# EAGLE design attiny_cortana (EAGLE 7.7.0)
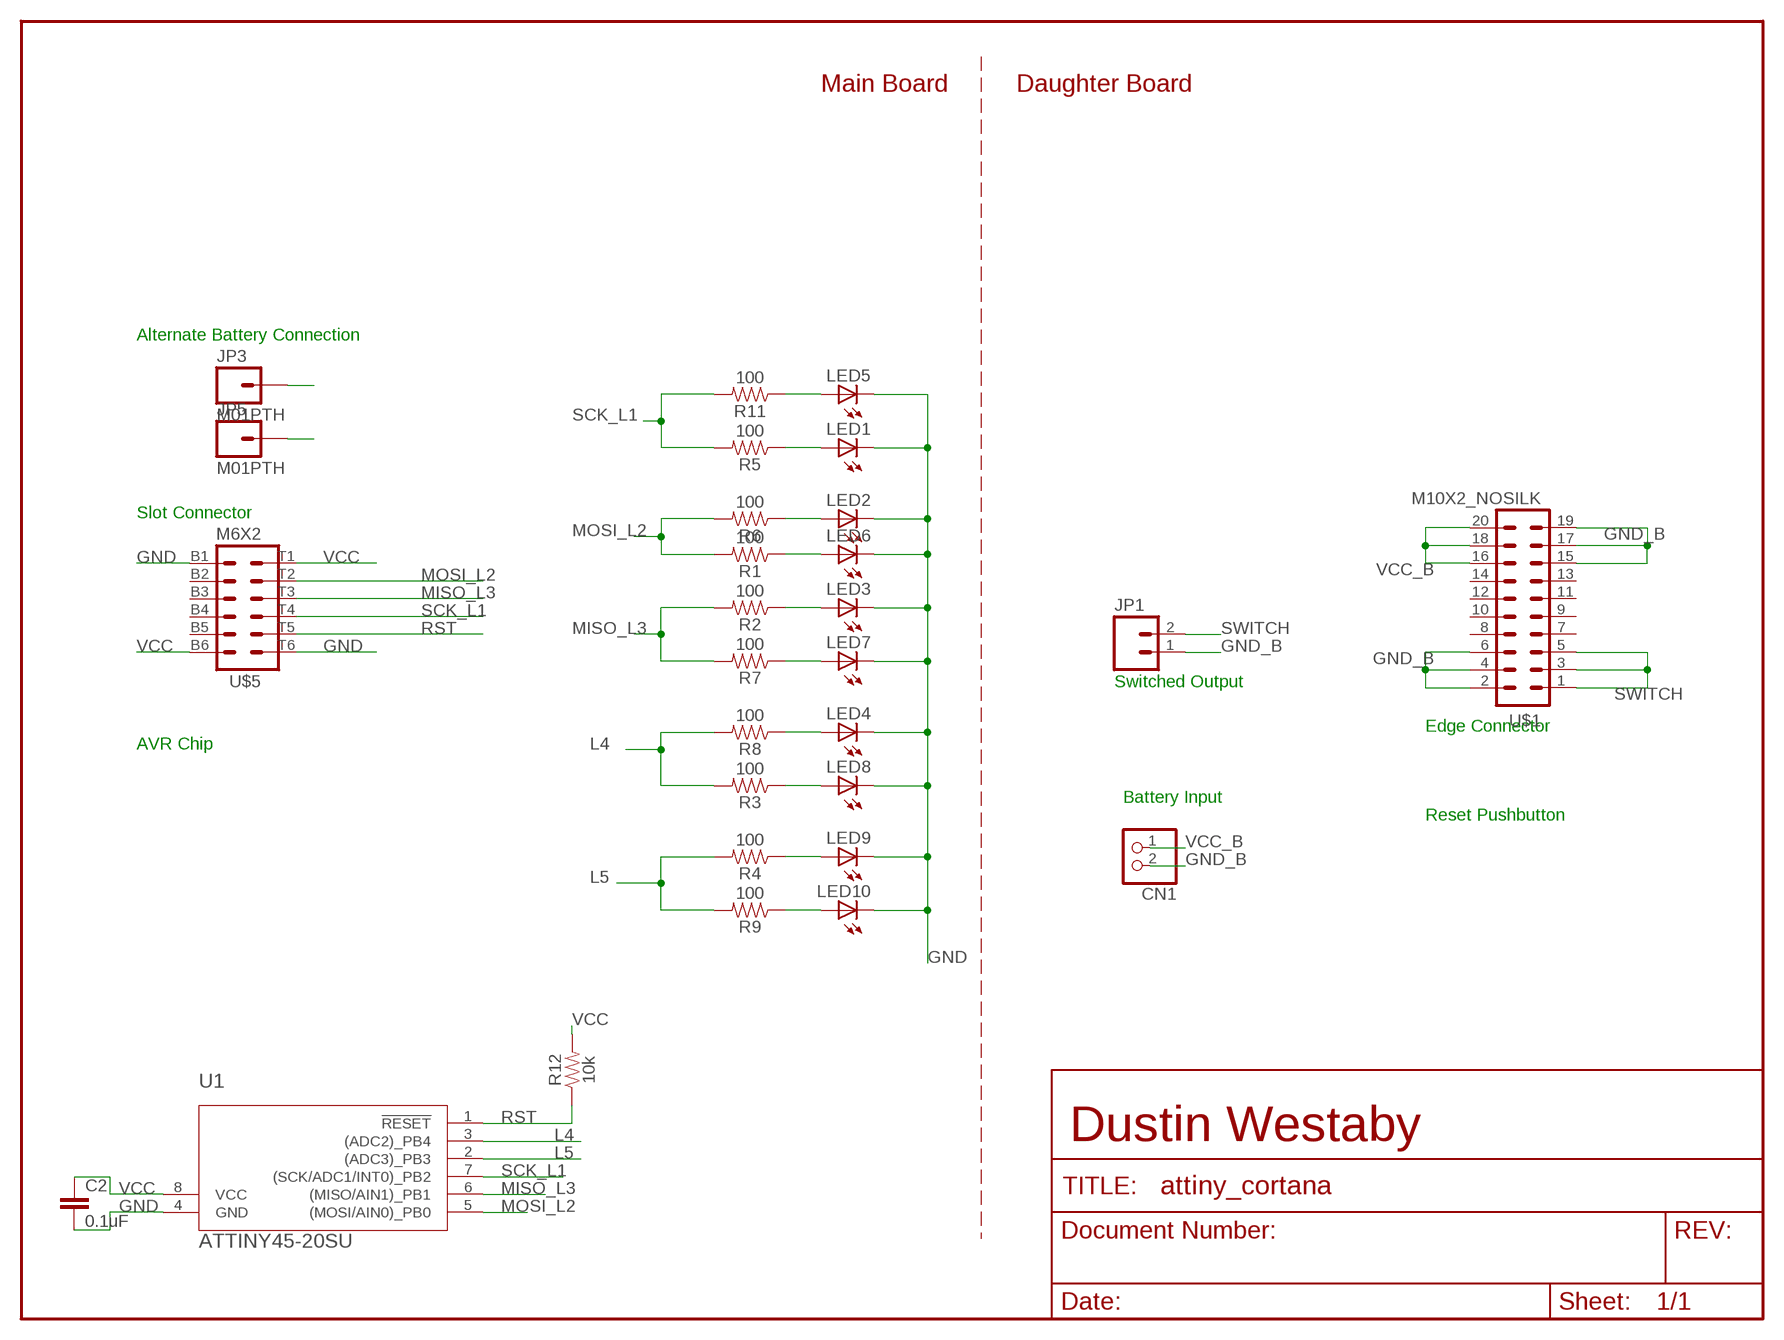
[diagram p0: schematic, sheet 1]

## Parts
C2  0.1uF  0.1UF-0402T-16V-10%  [0402-TIGHT]
CN1  JST_2PIN-THM-RA  [JST-PH-2-THM-RA]
JP1  M02PTH  [1X02]
JP3  M01PTH  [1X01]
JP5  M01PTH  [1X01]
LED1  LED0603  [LED-0603]
LED2  LED0603  [LED-0603]
LED3  LED0603  [LED-0603]
LED4  LED0603  [LED-0603]
LED5  LED0603  [LED-0603]
LED6  LED0603  [LED-0603]
LED7  LED0603  [LED-0603]
LED8  LED0603  [LED-0603]
LED9  LED0603  [LED-0603]
LED10  LED0603  [LED-0603]
R1  100  10KOHM-0402T-1/16W-1%  [0402-TIGHT]
R2  100  10KOHM-0402T-1/16W-1%  [0402-TIGHT]
R3  100  10KOHM-0402T-1/16W-1%  [0402-TIGHT]
R4  100  10KOHM-0402T-1/16W-1%  [0402-TIGHT]
R5  100  10KOHM-0402T-1/16W-1%  [0402-TIGHT]
R6  100  10KOHM-0402T-1/16W-1%  [0402-TIGHT]
R7  100  10KOHM-0402T-1/16W-1%  [0402-TIGHT]
R8  100  10KOHM-0402T-1/16W-1%  [0402-TIGHT]
R9  100  10KOHM-0402T-1/16W-1%  [0402-TIGHT]
R11  100  10KOHM-0402T-1/16W-1%  [0402-TIGHT]
R12  10k  10KOHM-0402T-1/16W-1%  [0402-TIGHT]
U1  ATTINY45-20SU  [8S2_ATM]
U$1  M10X2_NOSILK  [2X10_NOSILK]
U$5  M6X2  [CRT_CON]

## Nets
GND: C2.2 JP5.1 LED1.C LED2.C LED3.C LED4.C LED5.C LED6.C LED7.C LED8.C LED9.C LED10.C U1.4(GND) U$5.B1 U$5.T6
GND_B: CN1.2 JP1.1 U$1.2 U$1.4 U$1.6 U$1.15 U$1.17 U$1.19
L4: R3.2 R8.2 U1.3((ADC2)_PB4)
L5: R4.2 R9.2 U1.2((ADC3)_PB3)
MISO_L3: R2.2 R7.2 U1.6((MISO/AIN1)_PB1) U$5.T3
MOSI_L2: R1.2 R6.2 U1.5((MOSI/AIN0)_PB0) U$5.T2
N$1: LED3.A R2.1
N$2: LED4.A R8.1
N$3: LED1.A R5.1
N$4: LED6.A R1.1
N$5: LED2.A R6.1
N$6: LED5.A R11.1
N$7: LED7.A R7.1
N$8: LED8.A R3.1
N$9: LED9.A R4.1
N$10: LED10.A R9.1
RST: R12.1 U1.1(!RESET) U$5.T5
SCK_L1: R5.2 R11.2 U1.7((SCK/ADC1/INT0)_PB2) U$5.T4
SWITCH: JP1.2 U$1.1 U$1.3 U$1.5
VCC: C2.1 JP3.1 R12.2 U1.8(VCC) U$5.B6 U$5.T1
VCC_B: CN1.1 U$1.16 U$1.18 U$1.20
Unconnected: U$1.7 U$1.8 U$1.9 U$1.10 U$1.11 U$1.12 U$1.13 U$1.14 U$5.B2 U$5.B3 U$5.B4 U$5.B5

## Notes on the sheet
- Main Board | Daughter Board
- Alternate Battery Connection
- Slot Connector
- Switched Output
- Edge Connector
- AVR Chip
- Battery Input
- Reset Pushbutton
- Dustin Westaby

## Library data of the parts
C2 = SparkFun-Capacitors:0.1UF: 0.1µF ceramic capacitors A capacitor is a passive two-terminal electrical component used to store electrical energy temporarily in an electric field.; PROD_ID: CAP-12416
CN1 = adafruit:JST_2PIN: JST 2-Pin Connectors of various flavors SMT-RA (S2B-PH-SM4) 4UConnector #17311 SMT (B2B-PH-SM4) THM-RA (S2B-PH) THM (B2B-PH)
JP1 = SparkFun:M02: Header 2 Standard 2-pin 0.1" header. Use with straight break away headers (SKU : PRT-00116), right angle break away headers (PRT-00553), swiss pins (PRT-00743), machine pins (PRT-00117), and female headers (PRT-00115). Molex polarized connector foot print use with SKU : PRT-08233 with associated crimp pins and housings.
JP3 JP5 = SparkFun:M01: Header 1 Standard 1-pin 0.1" header. Use with straight break away headers (SKU : PRT-00116), right angle break away headers (PRT-00553), swiss pins (PRT-00743), machine pins (PRT-00117), and female headers (PRT-00115).
LED1-LED10 = SparkFun:LED: LEDs Standard schematic elements and footprints for 5mm, 3mm, 1206, and 0603 sized LEDs. 5mm - Spark Fun Electronics SKU : COM-00529 (and others)
R1-R9 R11 = SparkFun-Resistors:10KOHM: 10kΩ resistor A resistor is a passive two-terminal electrical component that implements electrical resistance as a circuit element. Resistors act to reduce current flow, and, at the same time, act to lower voltage levels within circuits. - Wikipedia; PROD_ID: RES-14241; VALUE: 10k
R12 = SparkFun-Resistors:10KOHM: 10kΩ resistor A resistor is a passive two-terminal electrical component that implements electrical resistance as a circuit element. Resistors act to reduce current flow, and, at the same time, act to lower voltage levels within circuits. - Wikipedia; PROD_ID: RES-14241
U1 = attinyx5_tssop8:ATTINY45-20SU; COPYRIGHT: Copyright (C) 2021 Ultra Librarian. All rights reserved.; DIGI-KEY_PART_NUMBER_1: ATCC-1252-ND; DIGI-KEY_PART_NUMBER_2: ATTINY45-20SU-ND; DIGI-KEY_PART_NUMBER_3: 2156-ATTINY45-20SU-ND; DIGI-KEY_PART_NUMBER_4: MCC-3845-ND; MANUFACTURER_PART_NUMBER: ATTINY45-20SU; MFR_NAME: Microchip
U$1 = dustin:M10X2_NOSILK
U$5 = dustin_01_2011:M6X2

## Board
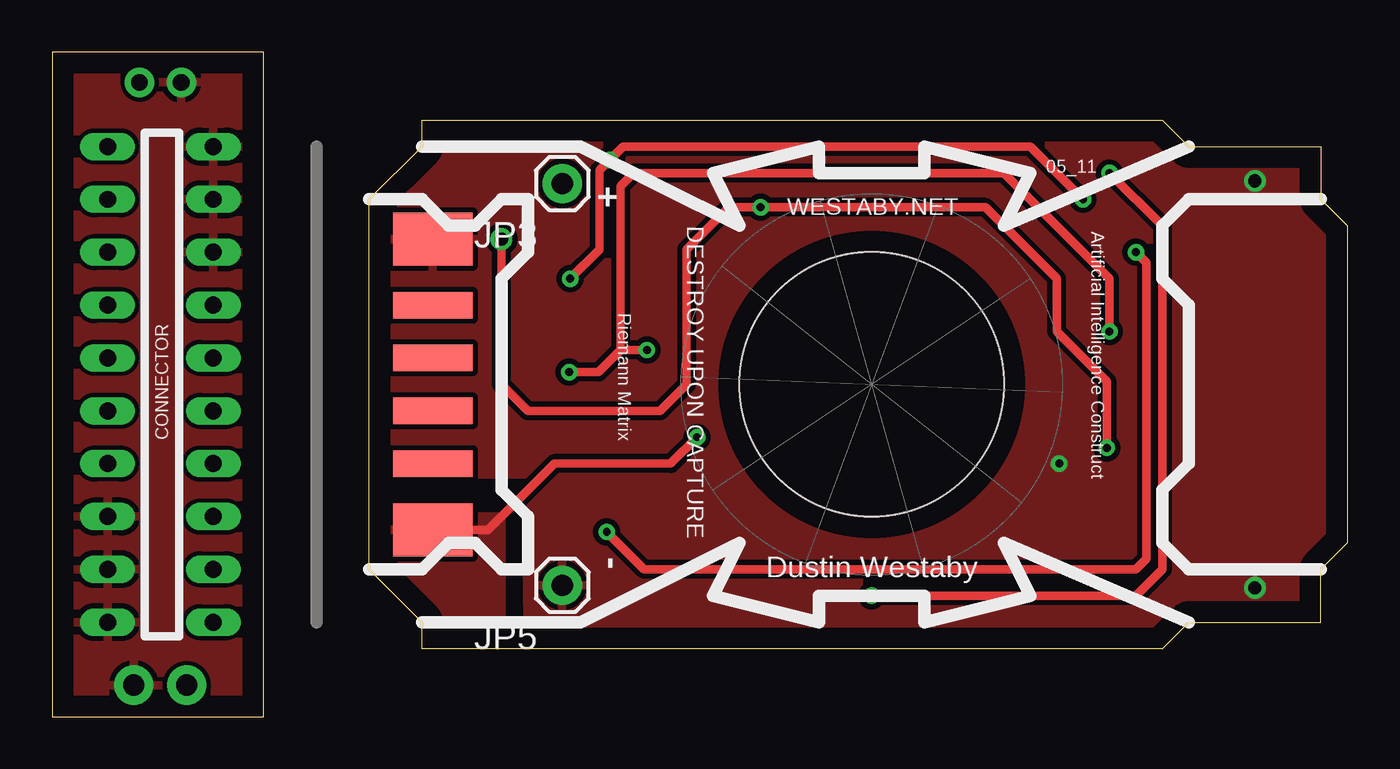
[diagram p1: board, top side]
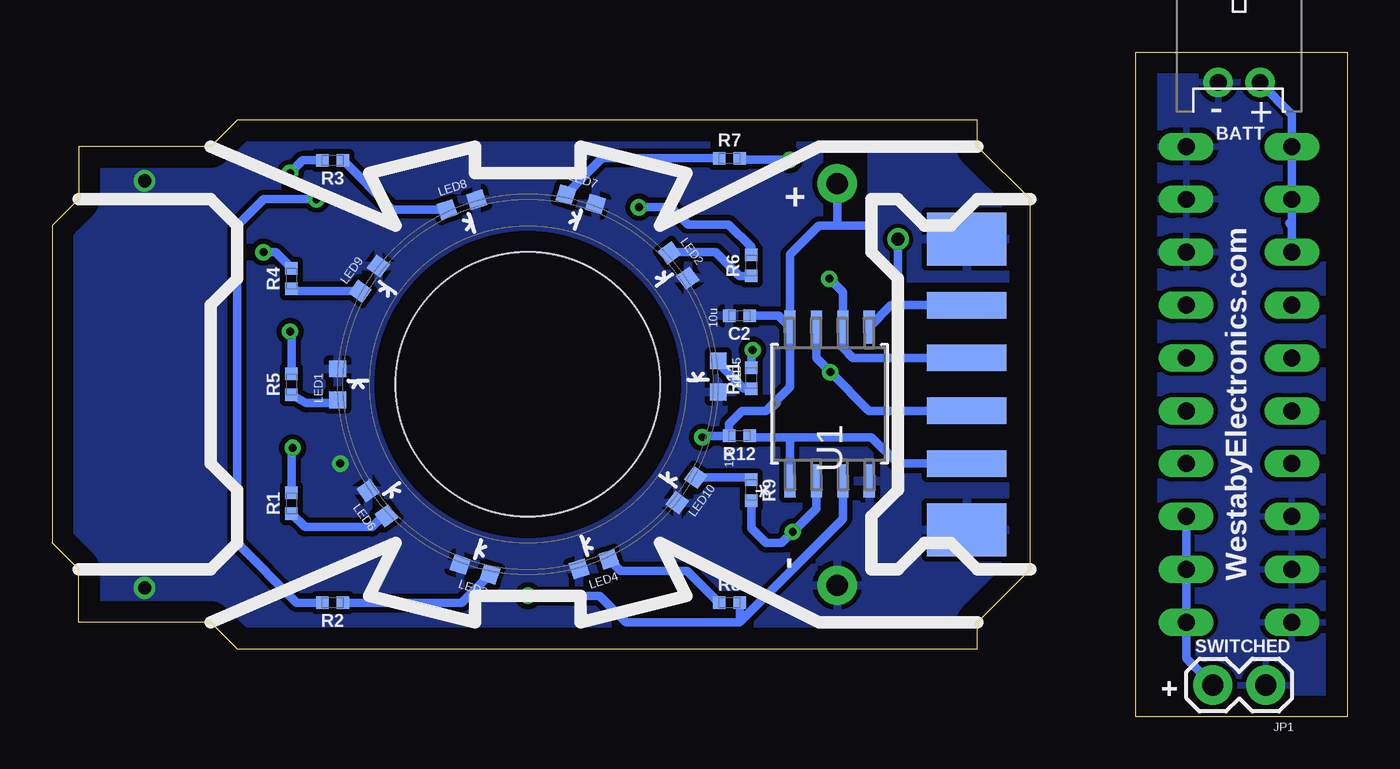
[diagram p2: board, bottom side, seen from below]

Size 62.23 x 31.94 mm. Coordinates in mm from the lower left corner, seen from the top.
Outline: 17.78,3.27 17.78,4.54 15.24,7.08 15.24,24.86 17.78,27.4 17.78,28.67 53.34,28.67 54.61,27.4 60.96,27.4 60.96,24.86 62.23,23.59 62.23,8.35 60.96,7.08 60.96,4.54 54.61,4.54 53.34,3.27 17.78,3.27
Outline: 10.16,0 10.16,31.94 0,31.94 0,0 10.16,0
Copper layers (1*16): Top 0.035mm / dielectric 1.5mm / Bottom 0.035mm
Design rules "default *": minimum track width 10mil, minimum drill 24mil, track to track 8mil, track to pad 8mil, pad to pad 8mil, via to via 8mil, smd to smd 8mil, copper to edge 40mil, drill to drill 8mil, minimum pad ring 10mil, minimum via ring 8mil, stop-mask expansion 4mil, vias tented up to drill 25mil, thermal gap 10mil
Holes 12.7 mm at 39.37,15.97

### Footprints (pad centres in the part's own frame; a part is rotated, then mirrored left to right if it is on the bottom)
0402-TIGHT = smd 0.6 x 0.6: 1 -0.5,0; 2 0.5,0
JST-PH-2-THM-RA = drill 0.8 pad 1.422: 1 1,0; 2 -1,0
1X02 = drill 1.016 pad 1.88: 1 0,0; 2 2.54,0
1X01 = drill 1.016 pad 1.88: 1 0,0
LED-0603 = smd 0.8 x 0.8: A 0,-0.75; C 0,0.75
8S2_ATM = smd 1.575 x 0.533: 1 -3.696,1.905; 2 -3.696,0.635; 3 -3.696,-0.635; 4 -3.696,-1.905; 5 3.696,-1.905; 6 3.696,-0.635; 7 3.696,0.635; 8 3.696,1.905
2X10_NOSILK = drill 0.813 long: 1 -11.43,-1.905; 2 -11.43,3.175; 3 -8.89,-1.905; 4 -8.89,3.175; 5 -6.35,-1.905; 6 -6.35,3.175; 7 -3.81,-1.905; 8 -3.81,3.175; 9 -1.27,-1.905; 10 -1.27,3.175; 11 1.27,-1.905; 12 1.27,3.175; 13 3.81,-1.905; 14 3.81,3.175; 15 6.35,-1.905; 16 6.35,3.175; 17 8.89,-1.905; 18 8.89,3.175; 19 11.43,-1.905; 20 11.43,3.175
CRT_CON = smd 3.81 x 2.54 bottom: B1 0,6.985; B6 0,-6.985 | smd 3.81 x 1.27 bottom: B2 0,3.81; B3 0,1.27; B4 0,-1.27; B5 0,-3.81 | smd 3.81 x 2.54: T1 0,6.985; T6 0,-6.985 | smd 3.81 x 1.27: T2 0,3.81; T3 0,1.27; T4 0,-1.27; T5 0,-3.81

### Placement (x,y rotation side)
C2  29.21,19.27 180 bottom
CN1  5.21,30.48 0 bottom
JP1  3.93,1.52 180 bottom
JP3  24.51,25.62 180 top
JP5  24.51,6.32 180 top
LED1  48.51,15.97 0 bottom
LED2  32.13,21.68 216 bottom
LED3  41.91,7.08 72 bottom
LED4  36.2,7.33 108 bottom
LED5  30.23,16.35 180 bottom
LED6  46.61,10.25 36 bottom
LED7  36.83,24.86 252 bottom
LED8  42.54,24.61 288 bottom
LED9  46.99,21.05 324 bottom
LED10  31.75,10.89 144 bottom
R1  50.72,10.25 90 bottom
R2  48.75,5.48 180 bottom
R3  48.75,26.74 180 bottom
R4  50.72,21.05 90 bottom
R5  50.72,15.97 90 bottom
R6  28.64,21.68 90 bottom
R7  29.69,26.83 0 bottom
R8  29.69,5.48 0 bottom
R9  28.64,10.89 270 bottom
R11  28.64,16.27 90 bottom
R12  29.21,13.49 180 bottom
U1  24.88,15.03 90 bottom
U$1  5.84,15.97 90 top
U$5  18.29,15.97 0 bottom

### Tracks (layer width: path | path; a pad name or v marks a point on that pad's centre or on a via)
GND  (via drill 0.38, 0.64)
  other vias: 57.78,25.75 57.78,6.19 48.39,12.16
  pour Top (isolate 0.254): 62.23,3.27 62.23,28.67 15.24,28.67 15.11,11.65 22.73,11.65 22.86,3.27
  pour Bottom (isolate 0.254): 62.23,3.27 62.23,28.67 25.4,28.67 25.4,19.78 15.24,19.78 15.24,3.27
GND_B
  pour Top: 10.16,0 10.16,31.94 0,31.94 0,0
  pour Bottom: 10.16,0 10.16,31.94 0,31.94 0,0
L4  (via drill 0.38)
  Top 0.406: v50.8,26.13 53.34,23.59 53.34,7.08 52.07,5.81 v39.37,5.81
  Bottom 0.406: U1.3 24.25,9.5 29.19,4.56 | R3.2 50.19,26.74 v50.8,26.13 | v39.37,5.81 35.92,5.81 34.65,4.54 29.21,4.54 29.19,4.56 | R8.2 29.19,4.56
L5  (via drill 0.38)
  Top 0.406: v26.65,8.88 28.45,7.08 52.07,7.08 52.58,7.59 52.58,21.81 v52.07,22.32
  Bottom 0.406: U1.2 25.52,10.01 v26.65,8.88 27.18,8.35 27.94,8.35 28.64,9.05 R9.2 | v52.07,22.32 51.49,22.32 R4.2
MISO_L3  (via drill 0.38)
  Top 0.406: v24.89,21.05 26.29,22.45 26.29,26.26 v26.8,26.77 27.43,27.4 46.99,27.4 v49.53,24.86
  Bottom 0.406: U$5.T3 23.75,17.24 24.25,17.74 U1.6 24.25,20.4 v24.89,21.05 | v26.8,26.77 29.12,26.77 R7.2 | R2.2 50.47,5.48 53.34,8.35 53.34,23.59 52.07,24.86 v49.53,24.86
MOSI_L2  (via drill 0.38, 0.64)
  Top 0.406: v21.59,22.95 21.59,15.97 22.86,14.7 29.21,14.7 30.48,15.97 30.48,22.45 32.51,24.48 v34.04,24.48 44.83,24.48 48.26,21.05 48.26,18.51 50.67,16.1 v50.67,12.92
  Bottom 0.406: 21.59,19.78 U$5.T2 | v21.59,22.95 21.59,19.78 | 21.59,19.78 21.92,19.78 U1.5 | v34.04,24.48 32.51,24.48 31.69,23.65 29.72,23.65 28.64,22.57 R6.2 | R1.2 50.72,12.88 v50.67,12.92
N$1
  Bottom 0.406: LED3.A 41.73,6.32 42.56,5.48 R2.1
N$2
  Bottom 0.406: LED4.A 34.93,7.01 31.72,7.01 R8.1
N$3
  Bottom 0.406: LED1.A 48.66,15.07 50.02,15.07 R5.1
N$4
  Bottom 0.406: LED6.A 46.33,9.65 46.86,9.11 50.08,9.11 R1.1
N$5
  Bottom 0.406: LED2.A 32.54,22.32 30.35,22.32 29.22,21.18 R6.1
N$6
  Bottom 0.406: 30.09,17.24 LED5.A 30.23,16.99 29.01,15.77 R11.1
N$7
  Bottom 0.406: LED7.A 36.67,25.97 | 36.67,25.97 36.5,26.13 | R7.1 35.8,26.83 36.67,25.97
N$8
  Bottom 0.406: LED8.A 45.89,24.37 R3.1
N$9
  Bottom 0.406: LED9.A 50.61,20.44 R4.1
N$10
  Bottom 0.406: LED10.A 28.75,11.5 R9.1
RST
  Bottom 0.406: U$5.T5 21.59,12.16 22.86,13.43 26.67,13.43 | 26.67,13.43 28.64,13.43 R12.1 | U1.1 26.79,13.31 26.67,13.43
SCK_L1  (via drill 0.38)
  Top 0.406: v24.85,16.56 26.24,16.56 27.3,17.62 | 27.3,17.62 27.3,25.5 27.94,26.13 45.72,26.13 50.8,21.05 v50.8,18.51 | v28.57,17.62 27.3,17.62
  Bottom 0.406: U$5.T4 22.99,14.7 v24.85,16.56 | v24.85,16.56 24.72,16.69 | U1.7 25.52,17.23 v24.85,16.56 | R5.2 50.72,18.43 v50.8,18.51 | R11.2 28.64,17.56 v28.57,17.62
SWITCH
  Bottom 0.406: U$1.5 U$1.3 U$1.1 7.75,2.8 JP1.2
VCC  (via drill 0.38)
  Top 0.406: U$5.B6 20.96,8.98 24.13,12.16 29.72,12.16 v30.99,13.43
  Bottom 0.406: 18.41,23.59 18.41,22.45 U$5.T1 | 24.64,23.59 25.4,23.59 26.79,22.2 U1.8 | 24.64,23.59 22.86,23.59 | JP3.1 24.51,23.72 24.64,23.59 | U1.8 26.79,15.86 27.94,14.7 29.08,14.7 29.71,14.07 R12.2 30.92,13.49 v30.99,13.43 | C2.1 27.33,19.27 U1.8
  pour Bottom: 15.24,21.05 15.24,24.86 17.78,27.4 22.86,27.4 22.86,22.32 21.59,21.05
  pour Top: 21.59,9.62 15.24,9.62 15.24,7.08 17.78,4.54 17.78,3.27 21.59,3.27
VCC_B
  Bottom 0.406: U$1.16 2.67,23.59 | 2.67,23.59 U$1.18 U$1.20 2.67,28.94 CN1.1 | 2.67,23.59 2.79,23.72

### Text on the board
tPlace: 05_11 | + | WESTABY.NET | DESTROY UPON CAPTURE | Artificial Intelligence Construct | Riemann Matrix | CONNECTOR | - | Dustin Westaby
bPlace: BATT | + | 10u | 100 | 10k | - | WestabyElectronics.com | SWITCHED | +
tStop: O I S R
bStop: 08_21